# EAGLE design SOT-23-6_to_breadboard (EAGLE 8.5.1)
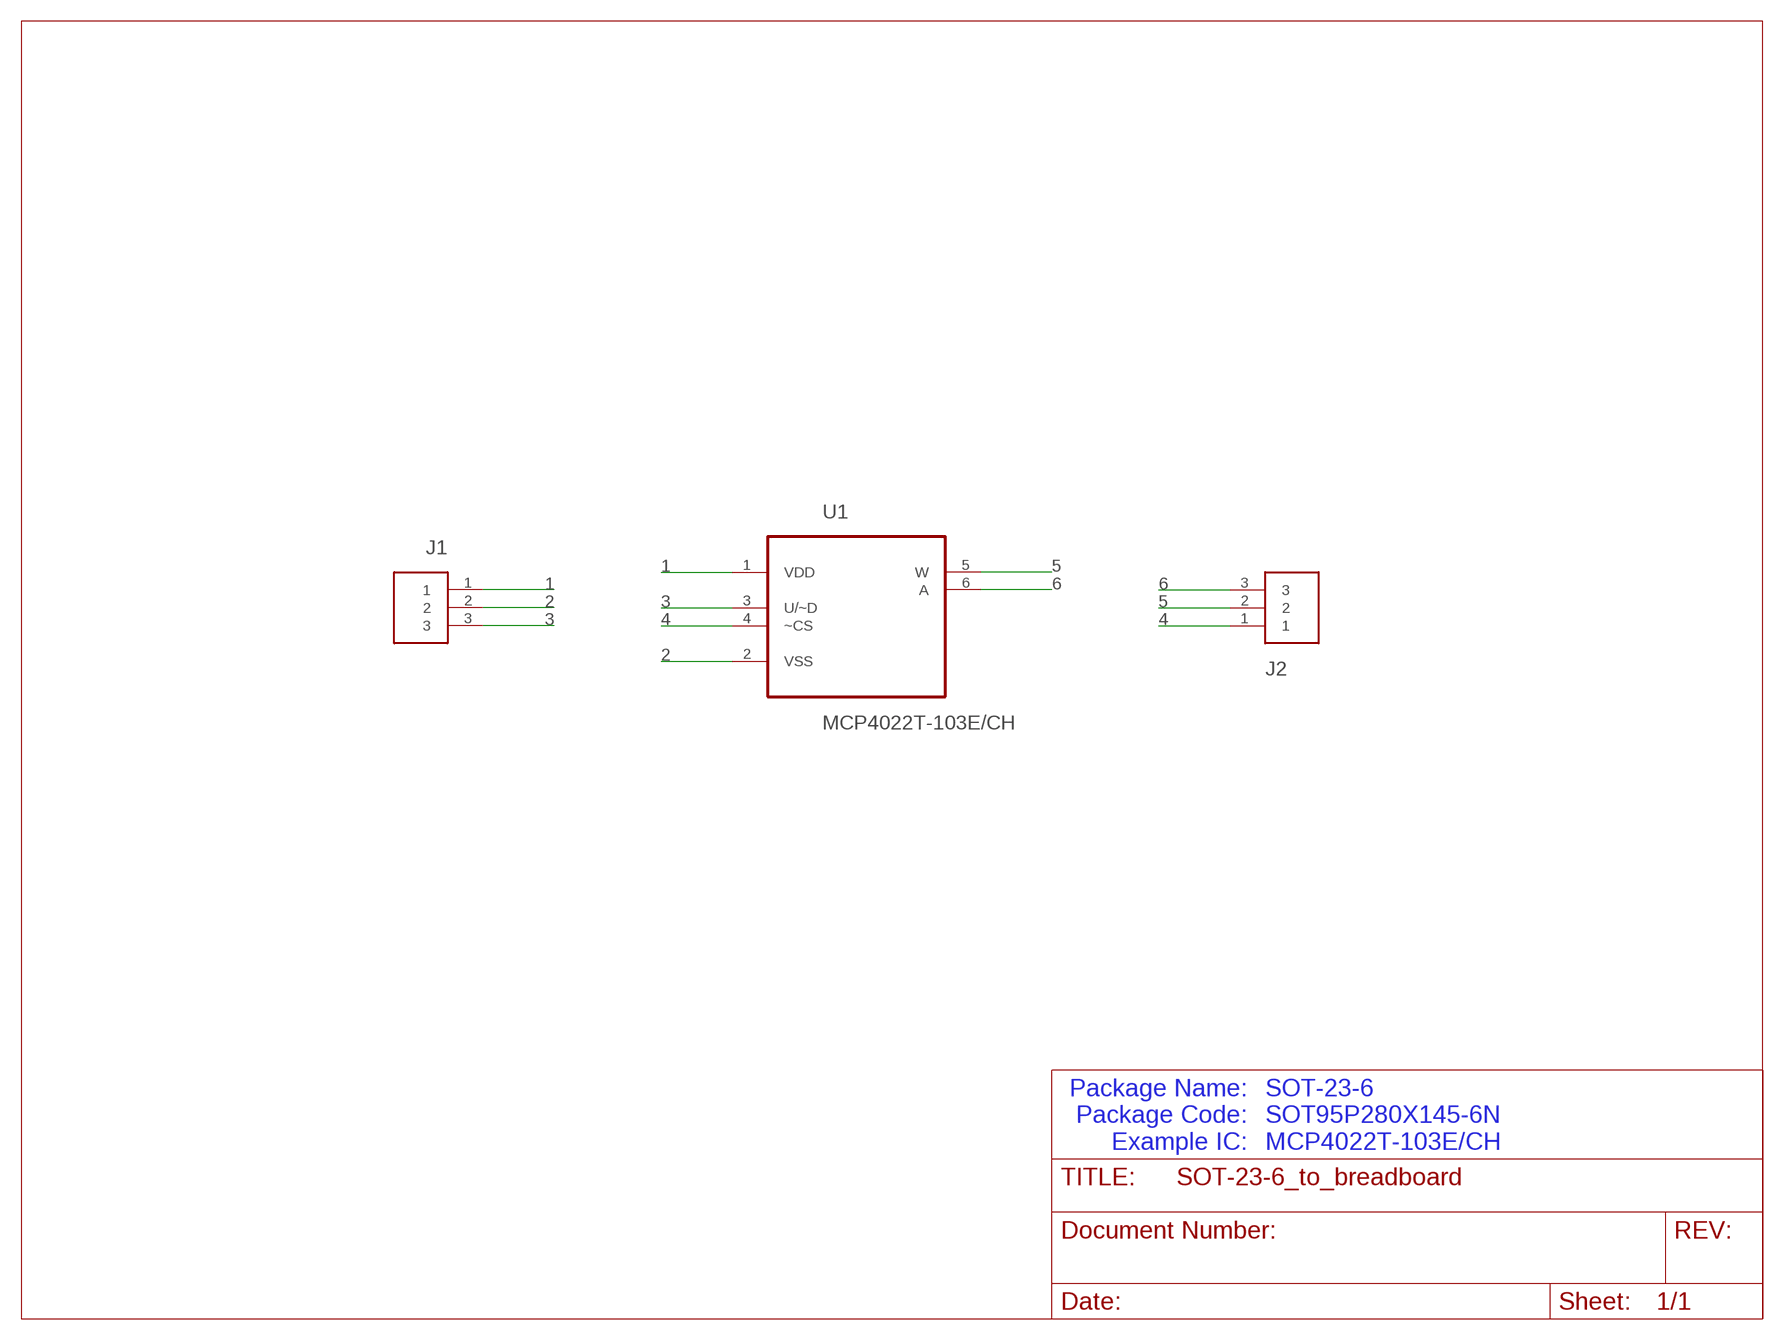
[diagram p0: schematic, sheet 1]

## Parts
J1  CONNECTOR_3  [68000-103HLF]
J2  CONNECTOR_3-NO_SQUARE  [68000-103HLF_NO_SQUARE]
U1  MCP4022T-103E/CH  [SOT95P280X145-6N]

## Nets
1: J1.1 U1.1(VDD)
2: J1.2 U1.2(VSS)
3: J1.3 U1.3(U/~D)
4: J2.1 U1.4(~CS)
5: J2.2 U1.5(W)
6: J2.3 U1.6(A)

## Notes on the sheet
- Package Name:
  Package Code:
  Example IC:
- SOT-23-6
  SOT95P280X145-6N
  MCP4022T-103E/CH

## Library data of the parts
J1 J2 = SnapEDA:CONNECTOR_3
U1 = SnapEDA:MCP4022T-103E/CH: Digital POT; AVAILABILITY: Good; DESCRIPTION: MCP4022 Series Non Volatile 64 Step 10 kOhm Digital Potentiometer - SOT-23-6; MF: Microchip; MP: MCP4022T-103E/CH; PACKAGE: SOT-23-6 Microchip; PRICE: 0.70 USD

## Board
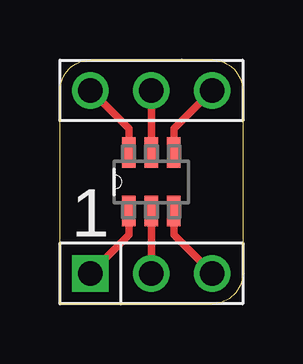
[diagram p1: board, top side]
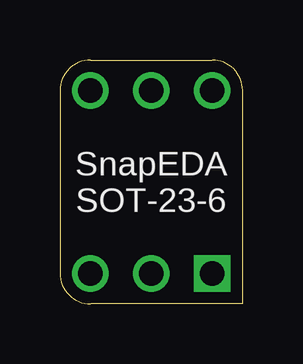
[diagram p2: board, bottom side, seen from below]

Size 7.63 x 10.16 mm. Coordinates in mm from the lower left corner, seen from the top.
Outline: 1.3,10.16 6.36,10.16 arc-90 7.63,8.89 arc0 7.63,1.27 arc-90 6.36,0
Outline: 6.34,0 0.01,0 arc0 0.01,8.89 arc-90 1.28,10.16
Copper layers (1*16): Top 0.035559375mm / dielectric 1.6mm / Bottom 0.035559375mm
Design rules "oshpark-2layer": minimum track width 6mil, minimum drill 10mil, track to track 6mil, track to pad 6mil, pad to pad 6mil, via to via 6mil, smd to smd 6mil, copper to edge 15mil, drill to drill 6mil, minimum pad ring 5mil, minimum via ring 5mil, stop-mask expansion 2.5mil, vias tented up to drill 0mil, thermal gap 10mil

### Footprints (pad centres in the part's own frame; a part is rotated, then mirrored left to right if it is on the bottom)
68000-103HLF = drill 1.016 square: 1 0,0 | drill 1.016: 2 2.54,0; 3 5.08,0
68000-103HLF_NO_SQUARE = drill 1.016: 1 0,0; 2 2.54,0; 3 5.08,0
SOT95P280X145-6N = smd 1.27 x 0.559: 1 -1.219,0.94; 2 -1.219,0; 3 -1.219,-0.94; 4 1.219,-0.94; 5 1.219,0; 6 1.219,0.94

### Placement (x,y rotation side)
J1  1.28,1.27 0 top
J2  6.36,8.89 180 top
U1  3.82,5.08 90 top

### Tracks (layer width: path | path; a pad name or v marks a point on that pad's centre or on a via)
1
  Top 0.305: U1.1 2.88,2.87 J1.1
2
  Top 0.305: U1.2 J1.2
3
  Top 0.305: U1.3 4.76,2.87 J1.3
4
  Top 0.305: U1.4 4.76,7.29 J2.1
5
  Top 0.305: U1.5 J2.2
6
  Top 0.305: U1.6 2.88,7.29 J2.3

### Text on the board
tPlace: 1
bPlace: SnapEDA / SOT-23-6